# EAGLE schematic piprojector (EAGLE 8.6.0)
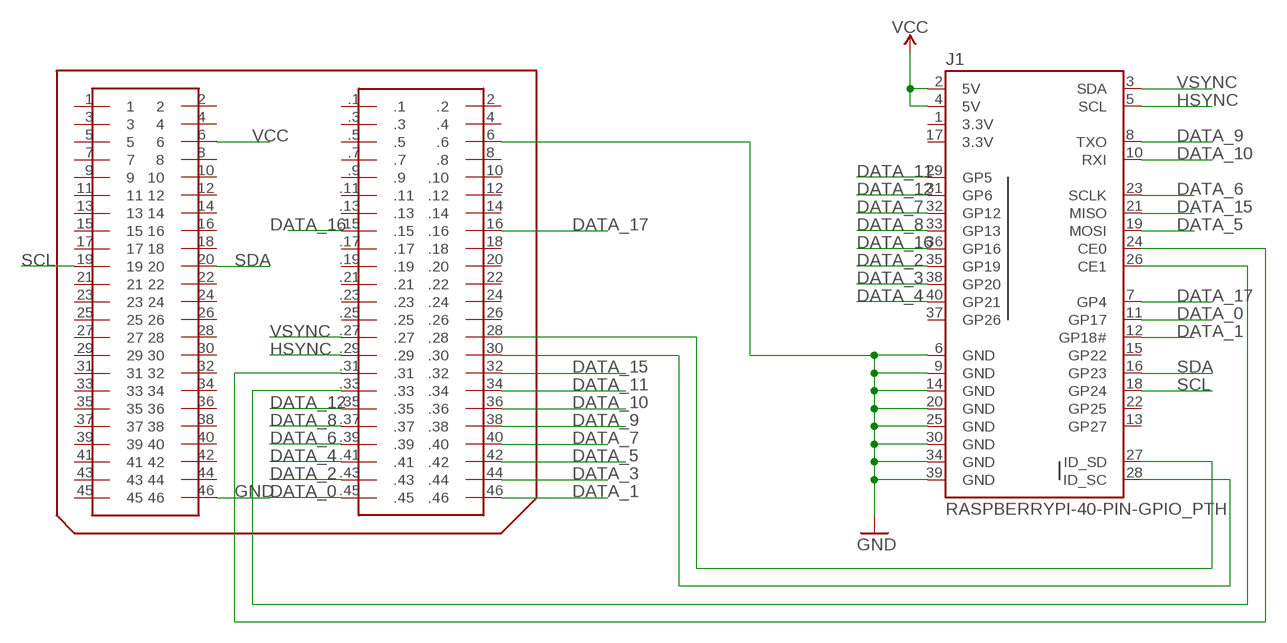
[diagram p0: schematic, sheet 1]

## Parts
J1  RASPBERRYPI-40-PIN-GPIO_PTH  [2X20_SHROUDED]
U$1  DLP2000  [DLP2000]

## Nets
DATA_0: J1.11(GP17) U$1..45
DATA_1: J1.12(GP18#) U$1..46
DATA_2: J1.35(GP19) U$1..43
DATA_3: J1.38(GP20) U$1..44
DATA_4: J1.40(GP21) U$1..41
DATA_5: J1.19(MOSI) U$1..42
DATA_6: J1.23(SCLK) U$1..39
DATA_7: J1.32(GP12) U$1..40
DATA_8: J1.33(GP13) U$1..37
DATA_9: J1.8(TXO) U$1..38
DATA_10: J1.10(RXI) U$1..36
DATA_11: J1.29(GP5) U$1..34
DATA_12: J1.31(GP6) U$1..35
DATA_15: J1.21(MISO) U$1..32
DATA_16: J1.36(GP16) U$1..15
DATA_17: J1.7(GP4) U$1..16
GND: J1.6(GND) J1.9(GND) J1.14(GND) J1.20(GND) J1.25(GND) J1.30(GND) J1.34(GND) J1.39(GND) U$1.46 U$1..6
HSYNC: J1.5(SCL) U$1..29
N$2: J1.24(CE0) U$1..31
N$3: J1.26(CE1) U$1..33
N$4: J1.28(ID_SC) U$1..30
N$6: J1.27(ID_SD) U$1..28
SCL: J1.18(GP24) U$1.19
SDA: J1.16(GP23) U$1.20
VCC: J1.2(5V) J1.4(5V) U$1.6
VSYNC: J1.3(SDA) U$1..27
Unconnected: J1.13(GP27) J1.15(GP22) J1.22(GP25) J1.37(GP26) U$1.1 U$1.2 U$1.3 U$1.4 U$1.5 U$1.7 U$1.8 U$1.9 U$1.10 U$1.11 U$1.12 U$1.13 U$1.14 U$1.15 U$1.16 U$1.17 U$1.18 U$1.21 U$1.22 U$1.23 U$1.24 U$1.25 U$1.26 U$1.27 U$1.28 U$1.29 U$1.30 U$1.31 U$1.32 U$1.33 U$1.34 U$1.35 U$1.36 U$1.37 U$1.38 U$1.39 U$1.40 U$1.41 U$1.42 U$1.43 U$1.44 U$1.45 U$1..1 U$1..2 U$1..3 U$1..4 U$1..5 U$1..7 U$1..8 U$1..9 U$1..10 U$1..11 U$1..12 U$1..13 U$1..14 U$1..17 U$1..18 U$1..19 U$1..20 U$1..21 U$1..22 U$1..23 U$1..24 U$1..25 U$1..26

## Power pins joined to a net without a drawn wire
3.3V: J1.1(3.3V) J1.17(3.3V)

## Library data of the parts
J1 = SparkFun-Connectors:RASPBERRYPI-40-PIN-GPIO: Raspberry Pi GPIO Header 2x20 pin connector, as found on B, B+, A+ models. Both shrouded PTH and SMT versions available. SparkFun Products: GPIO Shrouded Header <https://www.sparkfun.com/products/13054>- PTH SparkFun Pi Wedge (Preassembled) <https://www.sparkfun.com/products/13717>; PROD_ID: CONN-12263; SF_ID: PRT-13054
U$1 = DLP2000:DLP2000